# EAGLE design ESP32_C3_MotorDriver (EAGLE 9.6.2)
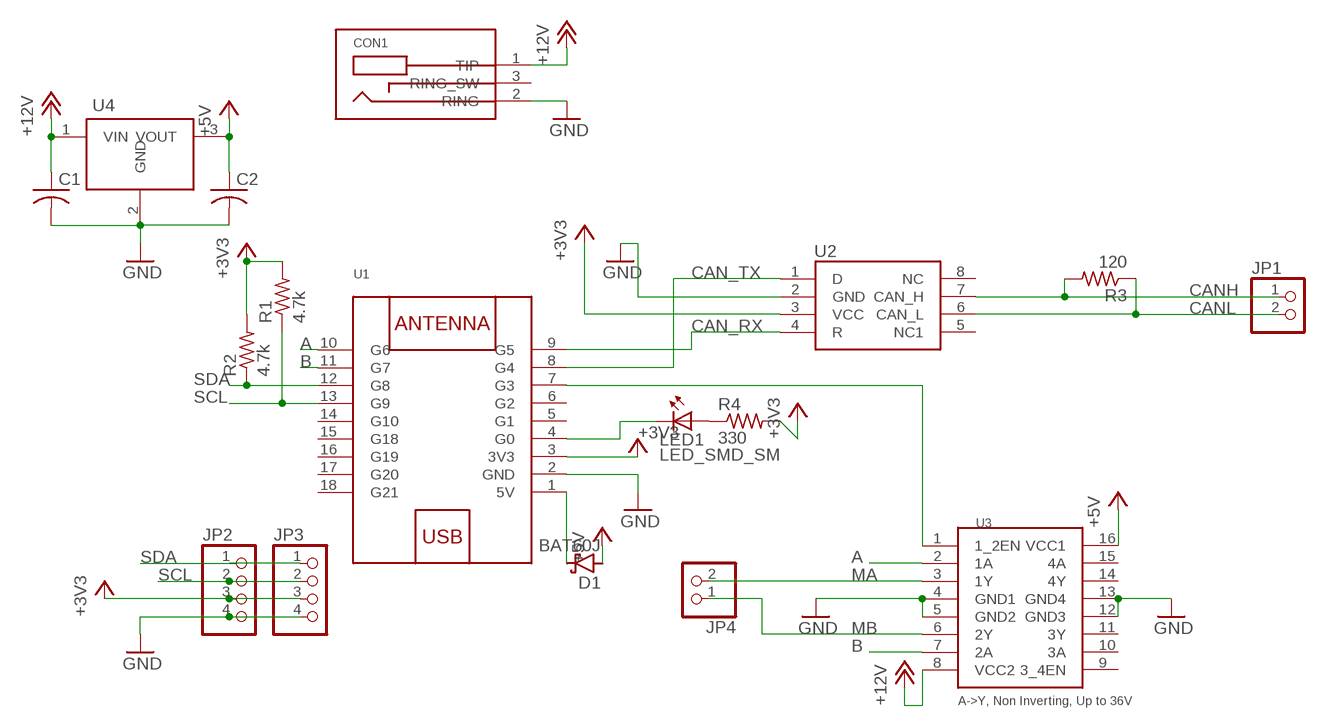
[diagram p0: schematic, sheet 1]

## Parts
C1  C-USC0805  [C0805]
C2  C-USC0805  [C0805]
CON1  BARREL_JACK_3PINPJ-102A_2MM_HOLES  [PJ-102A_2MM_HOLES]
D1  BAT60J  [SOD323_ST]
JP1  PINHD-1X2  [1X02]
JP2  PINHD-1X4  [1X04]
JP3  PINHD-1X4  [1X04]
JP4  PINHD-1X2  [1X02]
LED1  LED_SMD_SM  [LED_SMD_SM]
R1  4.7k  R-US_M0805  [M0805]
R2  4.7k  R-US_M0805  [M0805]
R3  120  R-US_M0805  [M0805]
R4  330  R-US_M0805  [M0805]
U1  ESP32C3ZERO  [ESP32SUPERMINI_ESP32-SUPERMINI]
U2  SN65HVD232DSOIC8  [SOIC-8]
U3  L293DDIP16  [DIP16_7.62MM]
U4  7805  [TO252-3]

## Nets
+3V3: JP2.3 JP3.3 R1.2 R2.2 R4.2 U1.3(3V3) U2.3(VCC)
+5V: C2.1 D1.A U3.16(VCC1) U4.3(VOUT)
+12V: C1.1 CON1.1(TIP) U3.8(VCC2) U4.1(VIN)
A: U1.10(G6) U3.2(1A)
B: U1.11(G7) U3.7(2A)
CAN_RX: U1.9(G5) U2.4(R)
CAN_TX: U1.8(G4) U2.1(D)
CANH: JP1.1 R3.2 U2.7(CAN_H)
CANL: JP1.2 R3.1 U2.6(CAN_L)
GND: C1.2 C2.2 CON1.2(RING) JP2.4 JP3.4 U1.2(GND) U2.2(GND) U3.4(GND1) U3.5(GND2) U3.12(GND3) U3.13(GND4) U4.2(GND)
MA: JP4.2 U3.3(1Y)
MB: JP4.1 U3.6(2Y)
N$1: U1.7(G3) U3.1(1_2EN)
N$2: D1.C U1.1(5V)
N$3: LED1.1(A) R4.1
N$4: LED1.2(C) U1.4(G0)
SCL: JP2.2 JP3.2 R1.1 U1.13(G9)
SDA: JP2.1 JP3.1 R2.1 U1.12(G8)
Unconnected: CON1.3(RING_SW) U1.5(G1) U1.6(G2) U1.14(G10) U1.15(G18) U1.17(G20) U1.18(G21) U2.5(NC1) U2.8(NC) U3.9(3_4EN) U3.10(3A) U3.11(3Y) U3.14(4Y) U3.15(4A)

## Power pins joined to a net without a drawn wire
G19: U1.16(G19)

## Library data of the parts
C1 C2 = DR:C-US: CAPACITOR, American symbol
CON1 = DR:BARREL_JACK_3PIN
D1 = diode:BAT60J: Schottky barrier diode Source: www.st.com, BAT60J.pdf
JP1 JP4 = pinhead:PINHD-1X2: PIN HEADER
JP2 JP3 = pinhead:PINHD-1X4: PIN HEADER
LED1 = DR:LED_SMD_SM
R1-R4 = DR:R-US_: RESISTOR, American symbol
U1 = ESP32C3supermini:ESP32C3ZERO
U2 = DR:SN65HVD232D
U3 = DR:L293D: Motor Driver, Quadruple Half-H, 4.5-36V
U4 = DR:7805

## Board
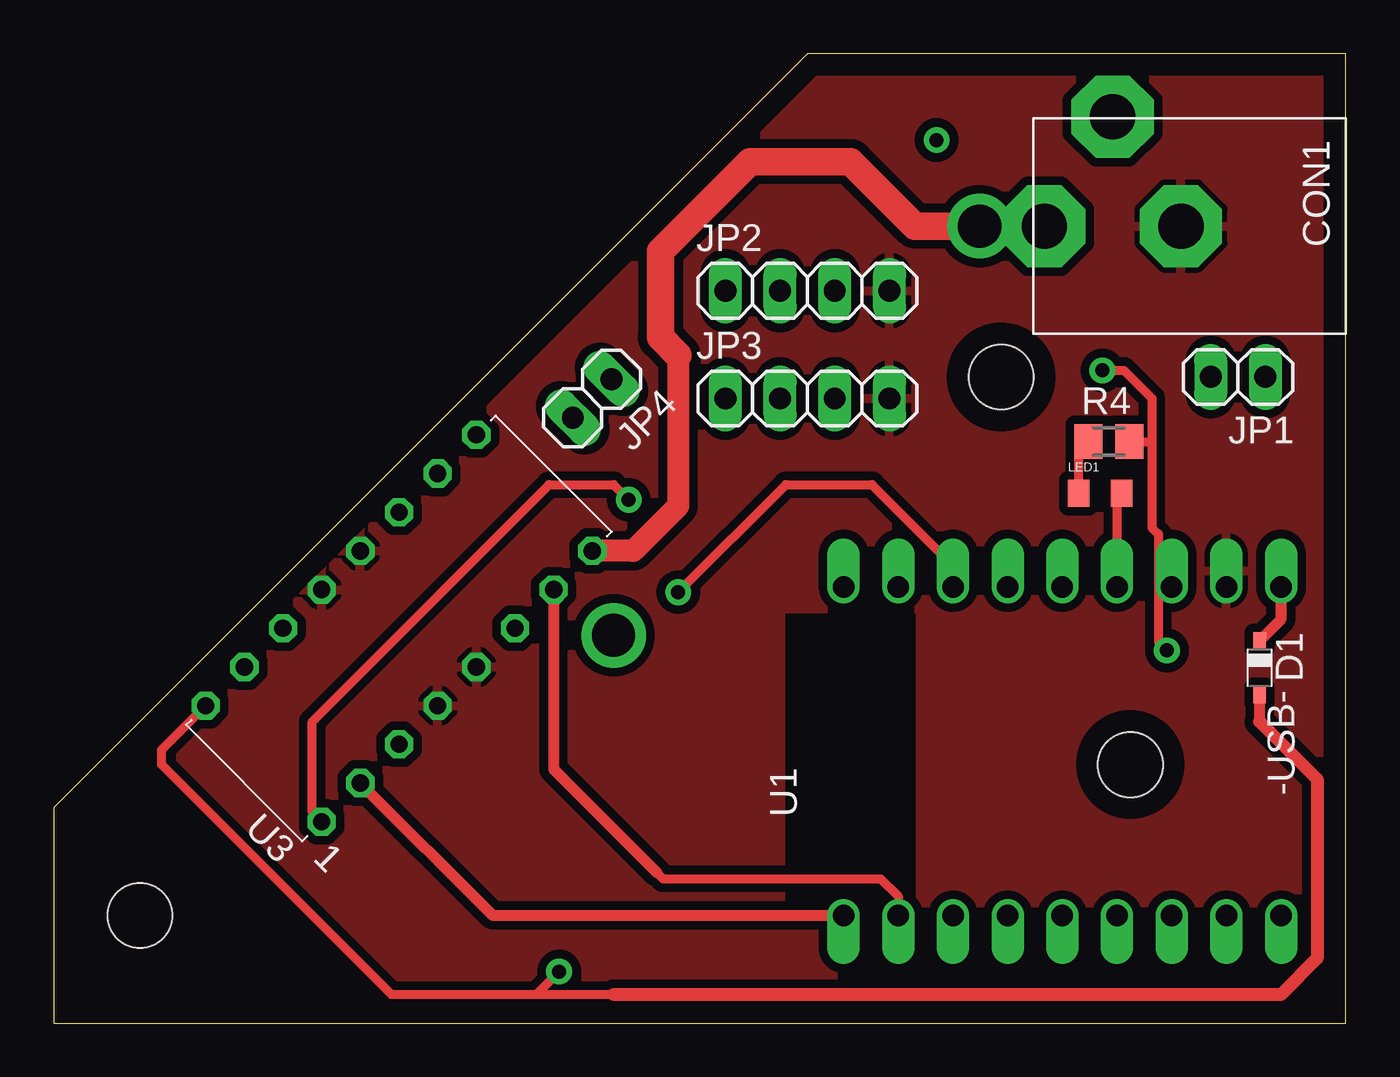
[diagram p1: board, top side]
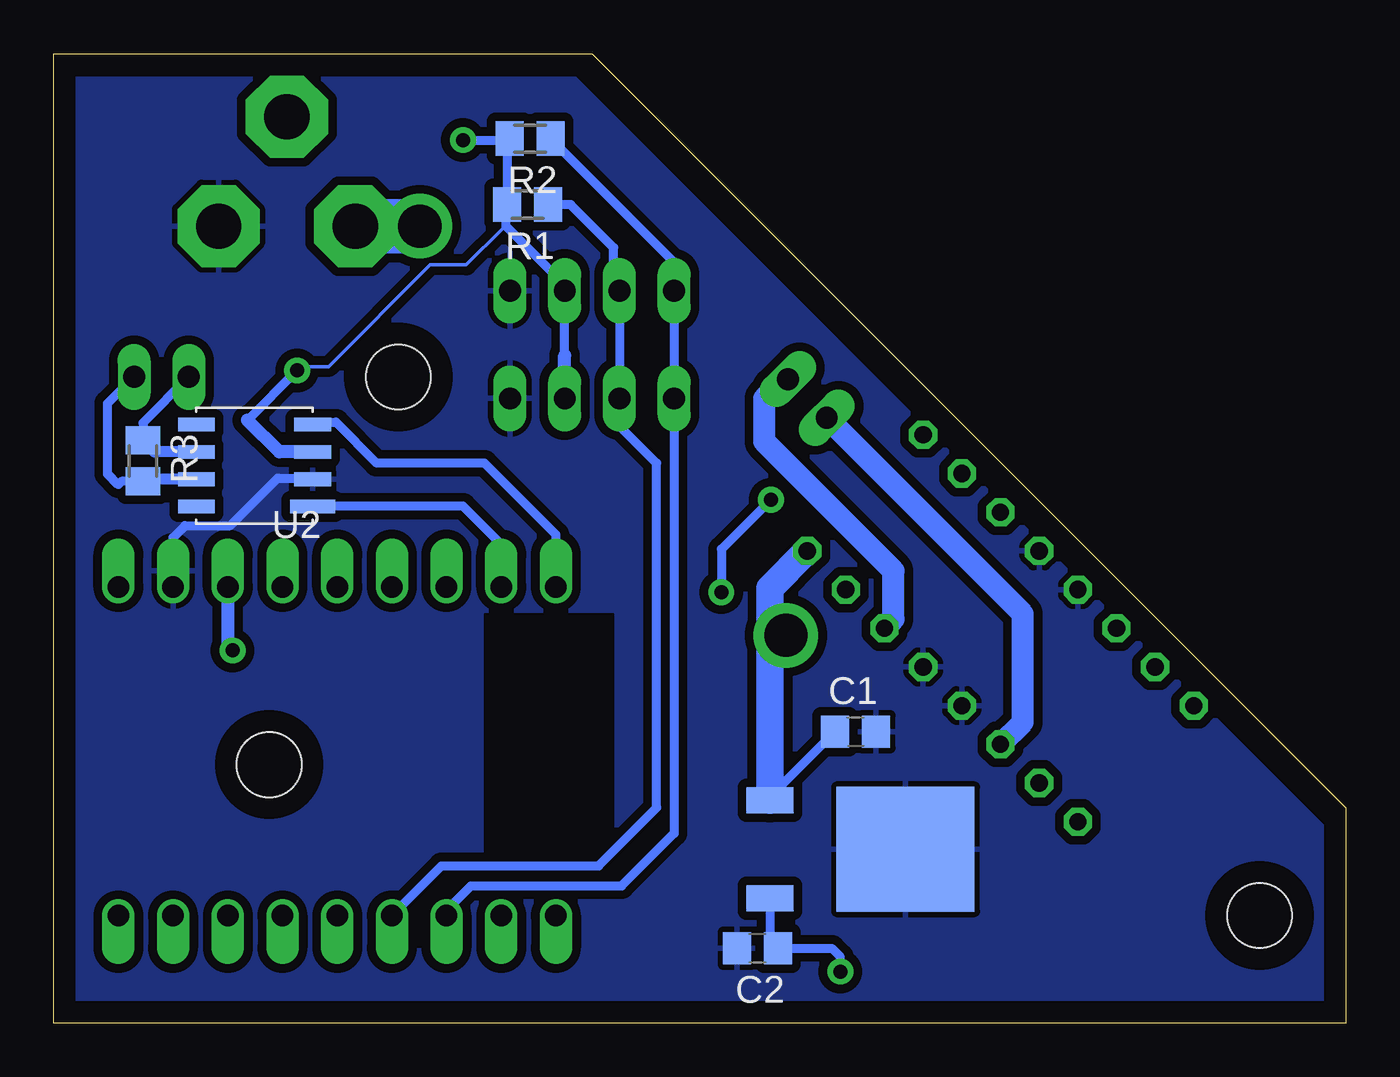
[diagram p2: board, bottom side, seen from below]

Size 60 x 45 mm. Coordinates in mm from the lower left corner, seen from the top.
Outline: 0,0 60,0 60,45 35,45 0,10 0,0
Copper layers (1*16): Top 0.035mm / dielectric 1.5mm / Bottom 0.035mm
Design rules "default": minimum track width 6mil, minimum drill 0.35mm, track to track 6mil, track to pad 6mil, pad to pad 6mil, via to via 6mil, smd to smd 6mil, copper to edge 40mil, drill to drill 6mil, minimum pad ring 10mil, minimum via ring 8mil, stop-mask expansion 4mil, vias tented up to drill 0mil, thermal gap 10mil
Holes 3 mm at 4,5 50,12 44,30

### Footprints (pad centres in the part's own frame; a part is rotated, then mirrored left to right if it is on the bottom)
C0805 = smd 1.3 x 1.5: 1 -0.95,0; 2 0.95,0
PJ-102A_2MM_HOLES = drill 2.1 pad 3.81 octagon: 1 0,0; 2 0,6.35; 3 -5.08,3.175
SOD323_ST = smd 0.8 x 0.6: A 1.25,0; C -1.25,0
1X02 = drill 1.016 long: 1 -1.27,0; 2 1.27,0
1X04 = drill 1.016 long: 1 -3.81,0; 2 -1.27,0; 3 1.27,0; 4 3.81,0
LED_SMD_SM = smd 1 x 1.25: 1 0,0; 2 2,0
M0805 = smd 1.3 x 1.6: 1 -0.95,0; 2 0.95,0
ESP32SUPERMINI_ESP32-SUPERMINI = drill 1 offset: 1 15.24,0; 2 15.24,2.54; 3 15.24,5.08; 4 15.24,7.62; 5 15.24,10.16; 6 15.24,12.7; 7 15.24,15.24; 8 15.24,17.78; 9 15.24,20.32; 10 0,20.32; 11 0,17.78; 12 0,15.24; 13 0,12.7; 14 0,10.16; 15 0,7.62; 16 0,5.08; 17 0,2.54; 18 0,0
SOIC-8 = smd 2.1 x 0.635: 1 0,0 | smd 1.7 x 0.635: 2 0,-1.27; 3 0,-2.54; 4 0,-3.81; 5 5.4,-3.81; 6 5.4,-2.54; 7 5.4,-1.27; 8 5.4,0
DIP16_7.62MM = drill 0.8 octagon: 1 0,0; 2 0,-2.54; 3 0,-5.08; 4 0,-7.62; 5 0,-10.16; 6 0,-12.7; 7 0,-15.24; 8 0,-17.78; 9 7.62,-17.78; 10 7.62,-15.24; 11 7.62,-12.7; 12 7.62,-10.16; 13 7.62,-7.62; 14 7.62,-5.08; 15 7.62,-2.54; 16 7.62,0
TO252-3 = smd 1.2 x 2.2: 1 0,0; 3 4.56,0 | smd 5.8 x 6.4: 2 2.28,6.3

### Placement (x,y rotation side)
C1  22.76,13.53 0 bottom
C2  27.32,3.47 180 bottom
CON1  46,37 270 top
D1  56,16.5 270 top
JP1  55,30 180 top
JP2  35,34 0 top
JP3  35,29 0 top
JP4  25,29 225 top
LED1  47.6,24.6 0 top
R1  38,38 180 bottom
R2  37.88,41.06 180 bottom
R3  55.86,26.1 270 bottom
R4  49,27 0 top
U1  57,5 90 top
U2  47.98,23.98 180 bottom
U3  12.44,9.35 135 top
U4  26.74,10.35 270 bottom

### Tracks (layer width: path | path; a pad name or v marks a point on that pad's centre or on a via)
+3V3  (via drill 0.65 pad 1.2)
  Top 0.406: v48.7,30.3 49.7,30.3 51,29 51,27 | v51.7,17.3 51.3,17.7 51.3,22.7 51,23 51,27 | R4.2 51,27
  Bottom 0.152: v48.7,30.3 48.62,30.48 47.24,30.48 42.52,35.2 40.84,35.2 39.17,36.88 39,37
  Bottom 0.406: 36.27,31 JP2.3 36.27,34.27 39,37 39,37.95 R1.2 38.95,40.94 R2.2 38.89,41 v41,41 | 51,28 v48.7,30.3
  Bottom 0.61: JP3.3 36.27,31 | U2.3 49.52,26.52 51,28 | U1.3 51.92,17.52 v51.7,17.3
+5V  (via drill 0.65 pad 1.2)
  Top 0.406: 26,1.32 22.4,1.32 | 22.4,1.32 15.68,1.32 5,12 5,12.69 U3.16 | v23.47,2.39 22.4,1.32
  Top 0.508: 56,14 D1.A
  Top 0.61: 56,14 58.68,11.32 58.68,3 57,1.32 26,1.32 | U3.16
  Bottom 0.406: U4.3 26.74,3.82 C2.1 23.87,3.47 23.47,3.07 v23.47,2.39
+12V  (via drill 2 pad 3)
  Top 1.016: 29,31 29,24 26.92,21.92 U3.8
  Top 1.27: v43,37 40,37 37,40 32.34,40 28.17,35.83 28.17,31.83 29,31
  Bottom 0.406: C1.1 26.74,10.5
  Bottom 1.27: U3.8 26.74,20.2 26.74,10.5 U4.1 26.74,17.26 v26,18
  Bottom 2.54: CON1.1 v43,37
A
  Top 0.508: U3.2 20.38,5 U1.10
B
  Top 0.406: 28,7 28.3,6.7 38.4,6.7 39.22,5.88 U1.11
  Top 0.508: U3.7 23.22,11.78 28,7
BLANK
  cutout Top: 34,19 40,19 40,6 34,6
CAN_RX
  Bottom 0.152: U2.4 47.87,27.9
  Bottom 0.406: U1.9 36.68,22.68 40,26 45,26 46.9,27.9 47.87,27.9
CAN_TX
  Bottom 0.406: U1.8 39.22,22.22 41,24 47.96,24 U2.1
CANH
  Bottom 0.406: R3.2 56,25.15 56.85,25.15 57,25 57.5,25.5 57.5,28.77 JP1.1
  Bottom 0.508: U2.7 55.9,25.25 56,25.15
CANL
  Bottom 0.406: JP1.2 55.86,27.87 R3.1
  Bottom 0.508: U2.6 55.33,26.52 R3.1
CUTOUT
  cutout Bottom: 34,19 40,19 40,6 34,6
GND
  Bottom 0.406: U1.2 54.46,22.54 53.9,23.1 51.8,23.1 49.6,25.3 48.03,25.3 U2.2
  pour Bottom (isolate 0.406): 1,1 1,9 36,44 61,44 61,1
  pour Top (isolate 0.406): -2,0 -2,10 35,47 61,47 61,0
MA
  Bottom 1.016: U3.3 15,13.97 15,19 JP4.2
MB
  Bottom 1.016: U3.6 21,18.75 21,21 27,27 27,29 26.1,29.9 JP4.1
N$1  (via drill 0.65 pad 1.2)
  Top 0.406: U1.7 41.76,21.24 38,25 34,25 v29,20 | U3.1 12,9.79 12,14 23,25 26,25 v26.7,24.3
  Bottom 0.406: v26.7,24.3 29,22 v29,20
N$2
  Top 0.508: D1.C 57,18.75 U1.1
N$3
  Top 0.406: R4.1 47.6,27 LED1.1
N$4
  Top 0.406: LED1.2 49.38,24.38 U1.4
SCL
  Bottom 0.406: U1.13 42,7.3 34.7,7.3 32,10 32,26 34,28 34,28.73 JP3.2 JP2.2 34,34.27 34,36 36,38 R1.1
SDA
  Bottom 0.406: U1.12 41.76,5.24 40.63,6.37 33.63,6.37 31.19,8.81 JP3.1 JP2.1 31.19,35.32 R2.1